# Altium schematic sheet 5_Sd_Card.SchDoc
size A4; SheetNumber: 6; SheetTotal: 7
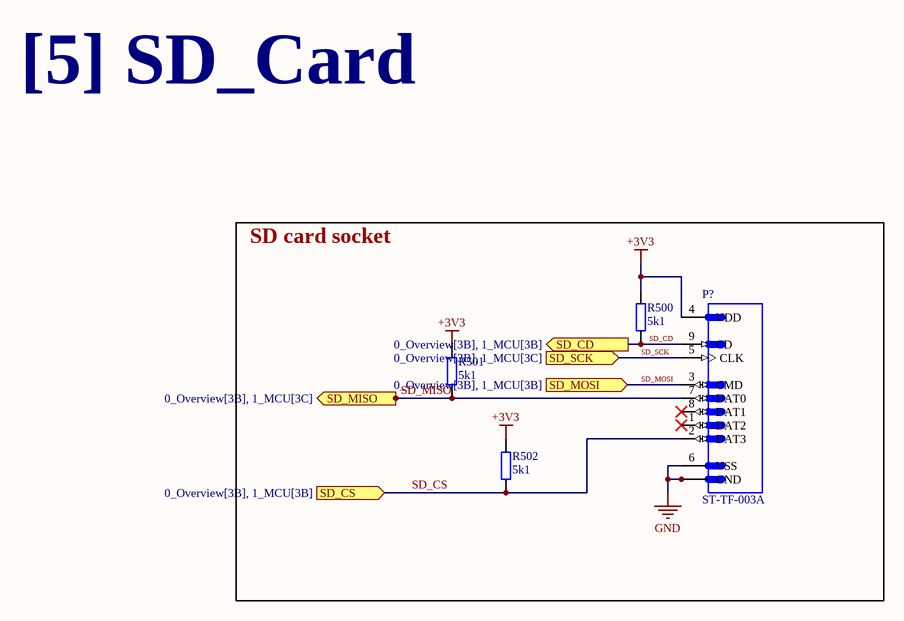
[diagram p0: 5_Sd_Card.SchDoc]

## Parts
P?  ST-TF-003A  [SUNTECH_ST-TF-003A]
R500  5k1  [RES_0603]
R501  5k1  [RES_0603]
R502  5k1  [RES_0603]

## Blocks framed on the sheet
SD card socket: P? R500-R502

## Ports
SD_CD (out, see 0_Overview[3B], 1_MCU[3B]), SD_CS (in, see 0_Overview[3B], 1_MCU[3B]), SD_MISO (out, see 0_Overview[3B], 1_MCU[3C]), SD_MOSI (in, see 0_Overview[3B], 1_MCU[3B]), SD_SCK (in, see 0_Overview[3B], 1_MCU[3C])

## Nets
+3V3: P?.4(VDD) R500.2 R501.2 R502.2
GND: P?.6(VSS) P?.G1(GND) P?.G2(GND) P?.G3(GND) P?.G4(GND)
SD_CD: P?.9(CD) R500.1 ; port SD_CD
SD_CS: P?.2(DAT3) R502.1 ; port SD_CS
SD_MISO: P?.7(DAT0) R501.1 ; port SD_MISO
SD_MOSI: P?.3(CMD) ; port SD_MOSI
SD_SCK: P?.5(CLK) ; port SD_SCK

Not connected (* = marked no-connect by the designer): P? 1(DAT2)* 8(DAT1)*

## Notes on the sheet
- [5] SD_Card

## Library data of the parts
P? = CMP-002-00072-2: Micro SD Card Socket; Case/Package: None; Source: ST-TF-003A.SchLib; Component Type: Standard; Availability: Unavailable; MP: ST-TF-003A; Value: *; Price: None; Design Item ID: ST-TF-003A; Pins: 13
R500-R502 = RES_0603: Resistor SMD 0603; Manufacturer: *; Manufacturer Part Number: *; Distributor Link: *; LCSC: *